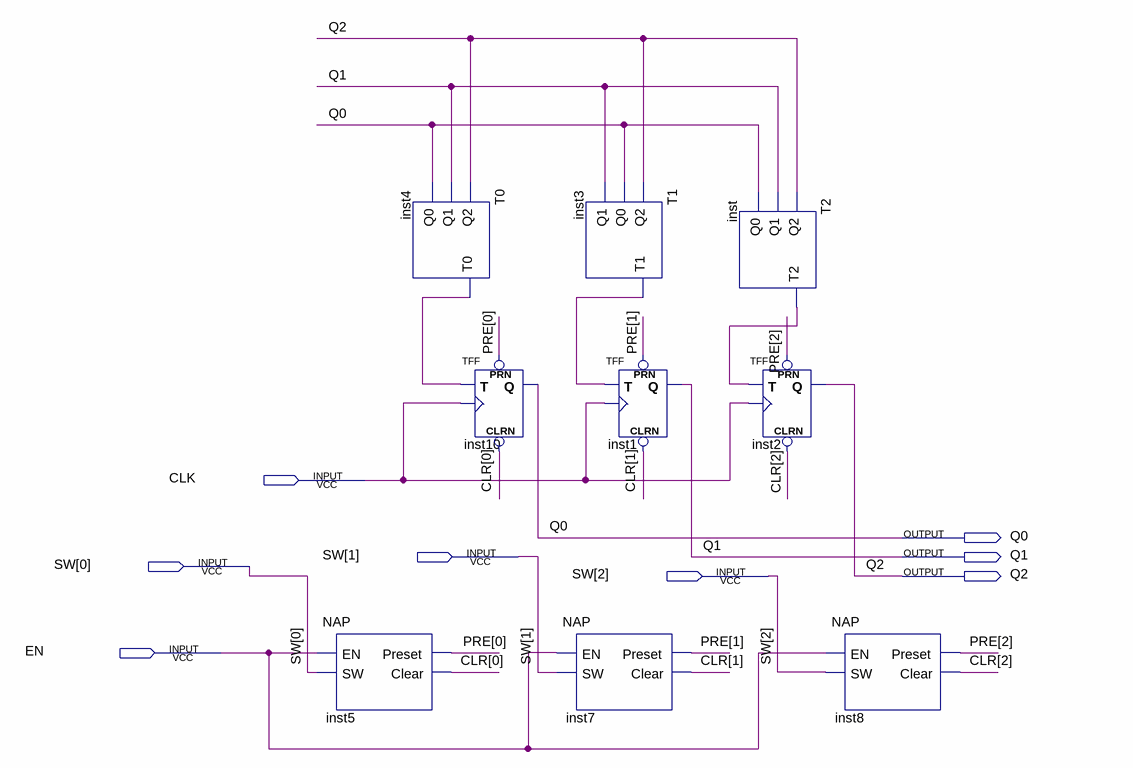
[diagram p0: schematic sheet]
// Quartus schematic LAB1.bdf as structural Verilog: 9 symbols, 8 pins
module LAB1 (
  input  CLK,
  input  [2:0] SW,
  input  EN,
  output Q0,
  output Q1,
  output Q2
);

  wire inst3_t1, inst4_t0, inst_t2;
  wire [2:0] CLR, PRE;

  NAP inst5 (.EN(EN), .SW(SW[0]), .Preset(PRE[0]), .Clear(CLR[0]));
  T0 inst4 (.Q2(Q2), .Q1(Q1), .Q0(Q0), .T0(inst4_t0));
  TFF inst10 (.PRN(PRE[0]), .CLRN(CLR[0]), .T(inst4_t0), .CLK(CLK), .Q(Q0));
  T1 inst3 (.Q2(Q2), .Q0(Q0), .Q1(Q1), .T1(inst3_t1));
  TFF inst1 (.PRN(PRE[1]), .CLRN(CLR[1]), .T(inst3_t1), .CLK(CLK), .Q(Q1));
  NAP inst7 (.EN(EN), .SW(SW[1]), .Preset(PRE[1]), .Clear(CLR[1]));
  T2 inst (.Q2(Q2), .Q1(Q1), .Q0(Q0), .T2(inst_t2));
  TFF inst2 (.PRN(PRE[2]), .CLRN(CLR[2]), .T(inst_t2), .CLK(CLK), .Q(Q2));
  NAP inst8 (.EN(EN), .SW(SW[2]), .Preset(PRE[2]), .Clear(CLR[2]));
endmodule
